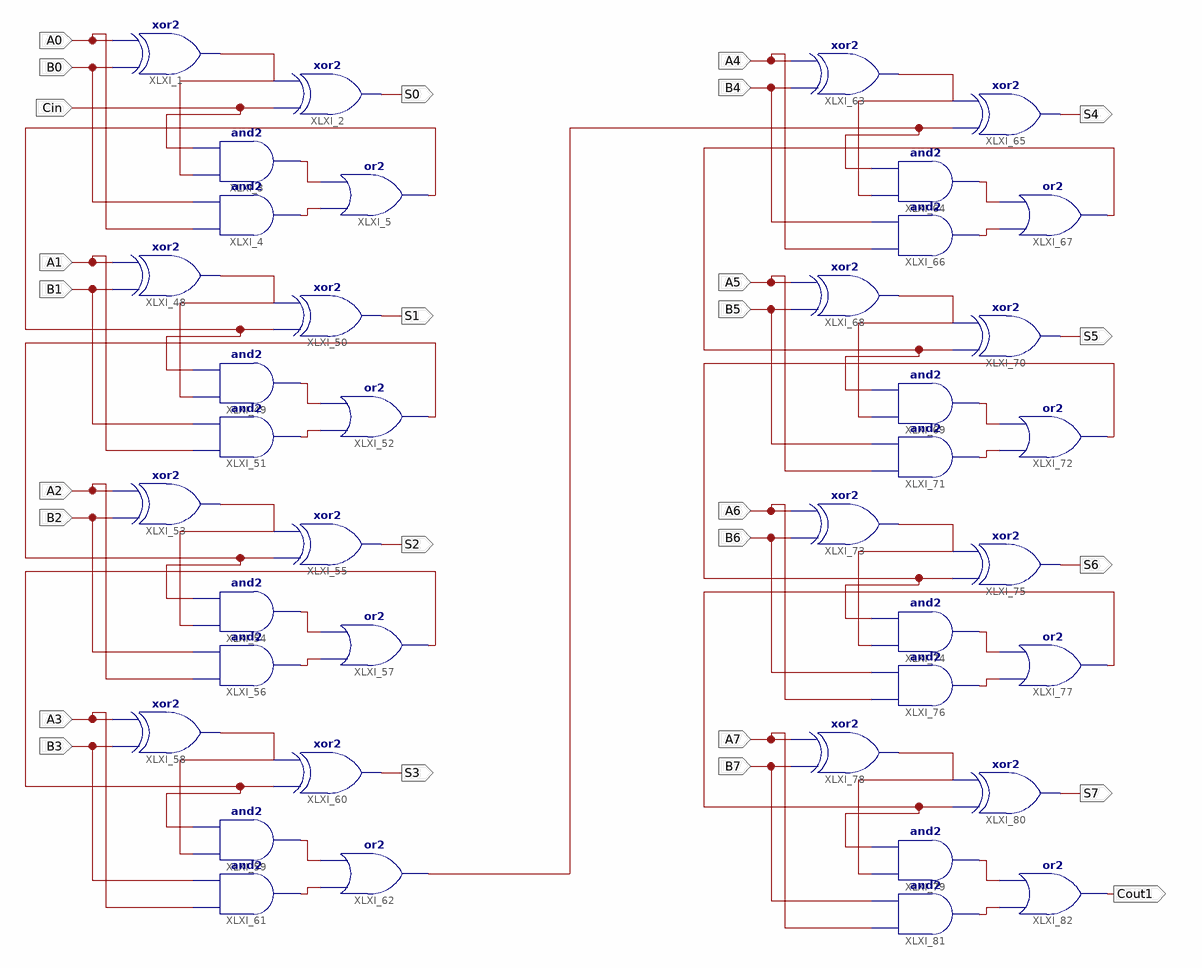
[diagram p0: schematic sheet 1]
// Xilinx ISE schematic full_adder.sch (spartan3e) as structural Verilog: 40 symbols, 26 ports
module full_adder (
  input  A0,
  input  Cin,
  input  B0,
  input  A1,
  input  B1,
  input  A2,
  input  B2,
  input  A3,
  input  B3,
  input  A4,
  input  B4,
  input  A5,
  input  B5,
  input  A6,
  input  B6,
  input  A7,
  input  B7,
  output S0,
  output S1,
  output S2,
  output S3,
  output S4,
  output S5,
  output S6,
  output S7,
  output Cout1
);

  wire Cout, Cout0, XLXN_1, XLXN_9, XLXN_10, XLXN_110, XLXN_111, XLXN_113, XLXN_116, XLXN_121, XLXN_122,
       XLXN_124, XLXN_127, XLXN_132, XLXN_133, XLXN_135, XLXN_143, XLXN_145, XLXN_146, XLXN_148, XLXN_153,
       XLXN_154, XLXN_156, XLXN_159, XLXN_163, XLXN_164, XLXN_166, XLXN_169, XLXN_174, XLXN_175, XLXN_177;

  xor XLXI_1 (XLXN_1, B0, A0);
  xor XLXI_2 (S0, Cin, XLXN_1);
  and XLXI_3 (XLXN_9, XLXN_1, Cin);
  and XLXI_4 (XLXN_10, A0, B0);
  or XLXI_5 (Cout0, XLXN_10, XLXN_9);
  xor XLXI_48 (XLXN_110, B1, A1);
  and XLXI_49 (XLXN_111, XLXN_110, Cout0);
  xor XLXI_50 (S1, Cout0, XLXN_110);
  and XLXI_51 (XLXN_113, A1, B1);
  or XLXI_52 (XLXN_116, XLXN_113, XLXN_111);
  xor XLXI_53 (XLXN_121, B2, A2);
  and XLXI_54 (XLXN_122, XLXN_121, XLXN_116);
  xor XLXI_55 (S2, XLXN_116, XLXN_121);
  and XLXI_56 (XLXN_124, A2, B2);
  or XLXI_57 (XLXN_127, XLXN_124, XLXN_122);
  xor XLXI_58 (XLXN_132, B3, A3);
  and XLXI_59 (XLXN_133, XLXN_132, XLXN_127);
  xor XLXI_60 (S3, XLXN_127, XLXN_132);
  and XLXI_61 (XLXN_135, A3, B3);
  or XLXI_62 (Cout, XLXN_135, XLXN_133);
  xor XLXI_63 (XLXN_145, B4, A4);
  and XLXI_64 (XLXN_146, XLXN_145, Cout);
  xor XLXI_65 (S4, Cout, XLXN_145);
  and XLXI_66 (XLXN_148, A4, B4);
  or XLXI_67 (XLXN_143, XLXN_148, XLXN_146);
  xor XLXI_68 (XLXN_153, B5, A5);
  and XLXI_69 (XLXN_154, XLXN_153, XLXN_143);
  xor XLXI_70 (S5, XLXN_143, XLXN_153);
  and XLXI_71 (XLXN_156, A5, B5);
  or XLXI_72 (XLXN_159, XLXN_156, XLXN_154);
  xor XLXI_73 (XLXN_163, B6, A6);
  and XLXI_74 (XLXN_164, XLXN_163, XLXN_159);
  xor XLXI_75 (S6, XLXN_159, XLXN_163);
  and XLXI_76 (XLXN_166, A6, B6);
  or XLXI_77 (XLXN_169, XLXN_166, XLXN_164);
  xor XLXI_78 (XLXN_174, B7, A7);
  and XLXI_79 (XLXN_175, XLXN_174, XLXN_169);
  xor XLXI_80 (S7, XLXN_169, XLXN_174);
  and XLXI_81 (XLXN_177, A7, B7);
  or XLXI_82 (Cout1, XLXN_177, XLXN_175);
endmodule
